# EAGLE schematic FloppyController_dsPIC (EAGLE 7.3.0)
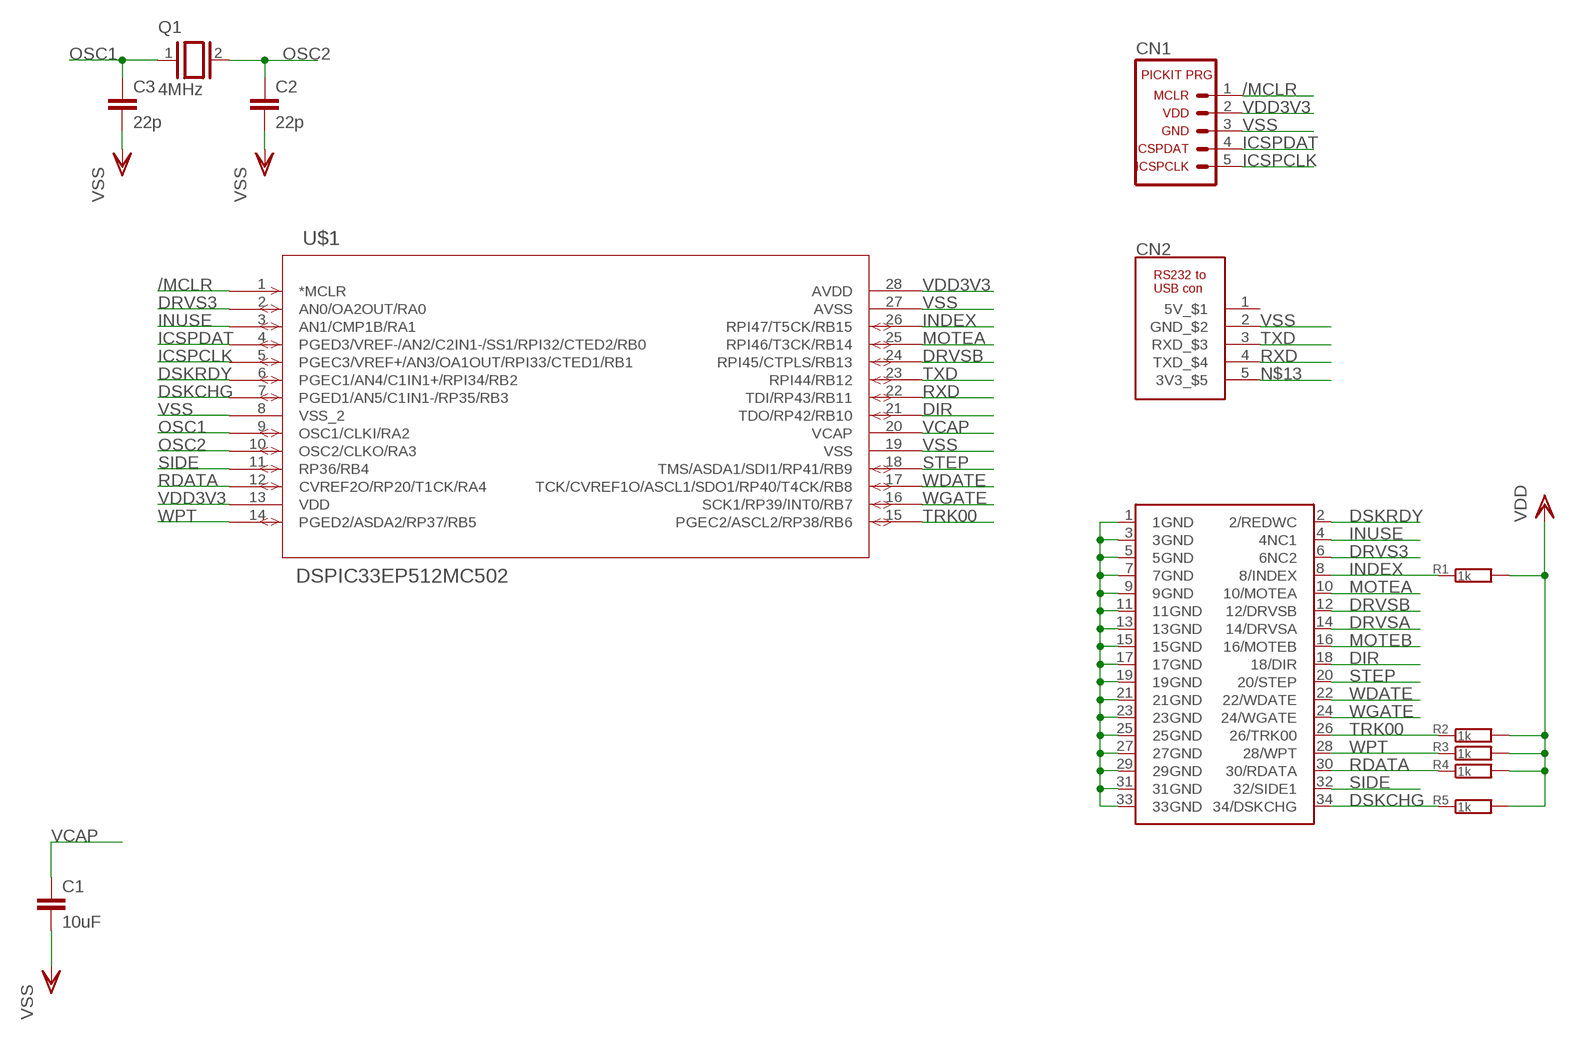
[diagram p0: schematic, sheet 1]

## Parts
C1  10uF  C-EUC0805BOTTOM  [C0805TOP]
C2  22p  C-EUC0603  [C0603]
C3  22p  C-EUC0603  [C0603]
CN1  PICKIT3CONNECTOR  [05P]
CN2  RS232_TO_USB_CONNECTOR  [05P]
Q1  4MHz  XTAL/S  [QS]
R1  1k  R-EU_M1206BOTTOM  [M1206]
R2  1k  R-EU_M1206BOTTOM  [M1206]
R3  1k  R-EU_M1206BOTTOM  [M1206]
R4  1k  R-EU_M1206BOTTOM  [M1206]
R5  1k  R-EU_M1206BOTTOM  [M1206]
U$1  DSPIC33EP512MC502  [SPDIP28_300MC]
U$2  FLOPPY_34PIN_CONN  [FLOPPY_34PIN_DUALROW]

## Nets
/MCLR: CN1.1(1_MCLR) U$1.1(*MCLR)
DIR: U$1.21(TDO/RP42/RB10) U$2.18(18/DIR)
DRVS3: U$1.2(AN0/OA2OUT/RA0) U$2.6(6NC2)
DRVSA: U$2.14(14/DRVSA)
DRVSB: U$1.24(RPI45/CTPLS/RB13) U$2.12(12/DRVSB)
DSKCHG: R5.1 U$1.7(PGED1/AN5/C1IN1-/RP35/RB3) U$2.34(34/DSKCHG)
DSKRDY: U$1.6(PGEC1/AN4/C1IN1+/RPI34/RB2) U$2.2(2/REDWC)
ICSPCLK: CN1.5(5_ICSPCLK) U$1.5(PGEC3/VREF+/AN3/OA1OUT/RPI33/CTED1/RB1)
ICSPDAT: CN1.4(4_ICSPDAT) U$1.4(PGED3/VREF-/AN2/C2IN1-/SS1/RPI32/CTED2/RB0)
INDEX: R1.1 U$1.26(RPI47/T5CK/RB15) U$2.8(8/INDEX)
INUSE: U$1.3(AN1/CMP1B/RA1) U$2.4(4NC1)
MOTEA: U$1.25(RPI46/T3CK/RB14) U$2.10(10/MOTEA)
MOTEB: U$2.16(16/MOTEB)
N$1: U$2.1(1GND) U$2.3(3GND) U$2.5(5GND) U$2.7(7GND) U$2.9(9GND) U$2.11(11GND) U$2.13(13GND) U$2.15(15GND) U$2.17(17GND) U$2.19(19GND) U$2.21(21GND) U$2.23(23GND) U$2.25(25GND) U$2.27(27GND) U$2.29(29GND) U$2.31(31GND) U$2.33(33GND)
N$13: CN2.5(3V3_$5)
OSC1: C3.1 Q1.1 U$1.9(OSC1/CLKI/RA2)
OSC2: C2.1 Q1.2 U$1.10(OSC2/CLKO/RA3)
RDATA: R4.1 U$1.12(CVREF2O/RP20/T1CK/RA4) U$2.30(30/RDATA)
RXD: CN2.4(TXD_$4) U$1.22(TDI/RP43/RB11)
SIDE: U$1.11(RP36/RB4) U$2.32(32/SIDE1)
STEP: U$1.18(TMS/ASDA1/SDI1/RP41/RB9) U$2.20(20/STEP)
TRK00: R2.1 U$1.15(PGEC2/ASCL2/RP38/RB6) U$2.26(26/TRK00)
TXD: CN2.3(RXD_$3) U$1.23(RPI44/RB12)
VCAP: C1.1 U$1.20(VCAP)
VDD: R1.2 R2.2 R3.2 R4.2 R5.2
VDD3V3: CN1.2(2_VDD) U$1.13(VDD) U$1.28(AVDD)
VSS: C1.2 C2.2 C3.2 CN1.3(3_GND) CN2.2(GND_$2) U$1.8(VSS_2) U$1.19(VSS) U$1.27(AVSS)
WDATE: U$1.17(TCK/CVREF1O/ASCL1/SDO1/RP40/T4CK/RB8) U$2.22(22/WDATE)
WGATE: U$1.16(SCK1/RP39/INT0/RB7) U$2.24(24/WGATE)
WPT: R3.1 U$1.14(PGED2/ASDA2/RP37/RB5) U$2.28(28/WPT)
Unconnected: CN2.1(5V_$1)

## Library data of the parts
C1-C3 = _MyComponents:C-EU: CAPACITOR, European symbol
CN1 = _MyComponents:PICKIT3CONNECTOR: PICKIT3 Programmer CONNECTOR; OC_FARNELL: unknown; OC_NEWARK: unknown
CN2 = _MyComponents:RS232_TO_USB_CONNECTOR
Q1 = special:XTAL/S: CRYSTAL
R1-R5 = _MyComponents:R-EU_: RESISTOR, European symbol
U$1 = _MyComponents:DSPIC33EP512MC502
U$2 = _MyComponents:FLOPPY_34PIN_CONN